# EAGLE design m5stack-doubleside-pinheader (EAGLE 8.6.3)
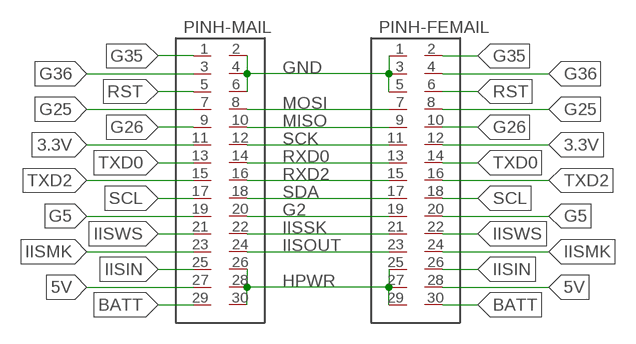
[diagram p0: schematic, sheet 1]

## Parts
PINH-FEMAIL  2X15  [SMD-PINH-2X15-C]
PINH-MAIL  2X15  [SMD-PINH-2X15-C]

## Nets
3.3V: PINH-FEMAIL.12 PINH-MAIL.11
5V: PINH-FEMAIL.28 PINH-MAIL.27
BATT: PINH-FEMAIL.30 PINH-MAIL.29
G2: PINH-FEMAIL.19 PINH-MAIL.20
G5: PINH-FEMAIL.20 PINH-MAIL.19
G25: PINH-FEMAIL.8 PINH-MAIL.7
G26: PINH-FEMAIL.10 PINH-MAIL.9
G35: PINH-FEMAIL.2 PINH-MAIL.1
G36: PINH-FEMAIL.4 PINH-MAIL.3
GND: PINH-FEMAIL.1 PINH-FEMAIL.3 PINH-FEMAIL.5 PINH-MAIL.2 PINH-MAIL.4 PINH-MAIL.6
HPWR: PINH-FEMAIL.25 PINH-FEMAIL.27 PINH-FEMAIL.29 PINH-MAIL.26 PINH-MAIL.28 PINH-MAIL.30
IISIN: PINH-FEMAIL.26 PINH-MAIL.25
IISMK: PINH-FEMAIL.24 PINH-MAIL.23
IISOUT: PINH-FEMAIL.23 PINH-MAIL.24
IISSK: PINH-FEMAIL.21 PINH-MAIL.22
IISWS: PINH-FEMAIL.22 PINH-MAIL.21
MISO: PINH-FEMAIL.9 PINH-MAIL.10
MOSI: PINH-FEMAIL.7 PINH-MAIL.8
RST: PINH-FEMAIL.6 PINH-MAIL.5
RXD0: PINH-FEMAIL.13 PINH-MAIL.14
RXD2: PINH-FEMAIL.15 PINH-MAIL.16
SCK: PINH-FEMAIL.11 PINH-MAIL.12
SCL: PINH-FEMAIL.18 PINH-MAIL.17
SDA: PINH-FEMAIL.17 PINH-MAIL.18
TXD0: PINH-FEMAIL.14 PINH-MAIL.13
TXD2: PINH-FEMAIL.16 PINH-MAIL.15

## Library data of the parts
PINH-FEMAIL PINH-MAIL = m5stack:2X15

## Board
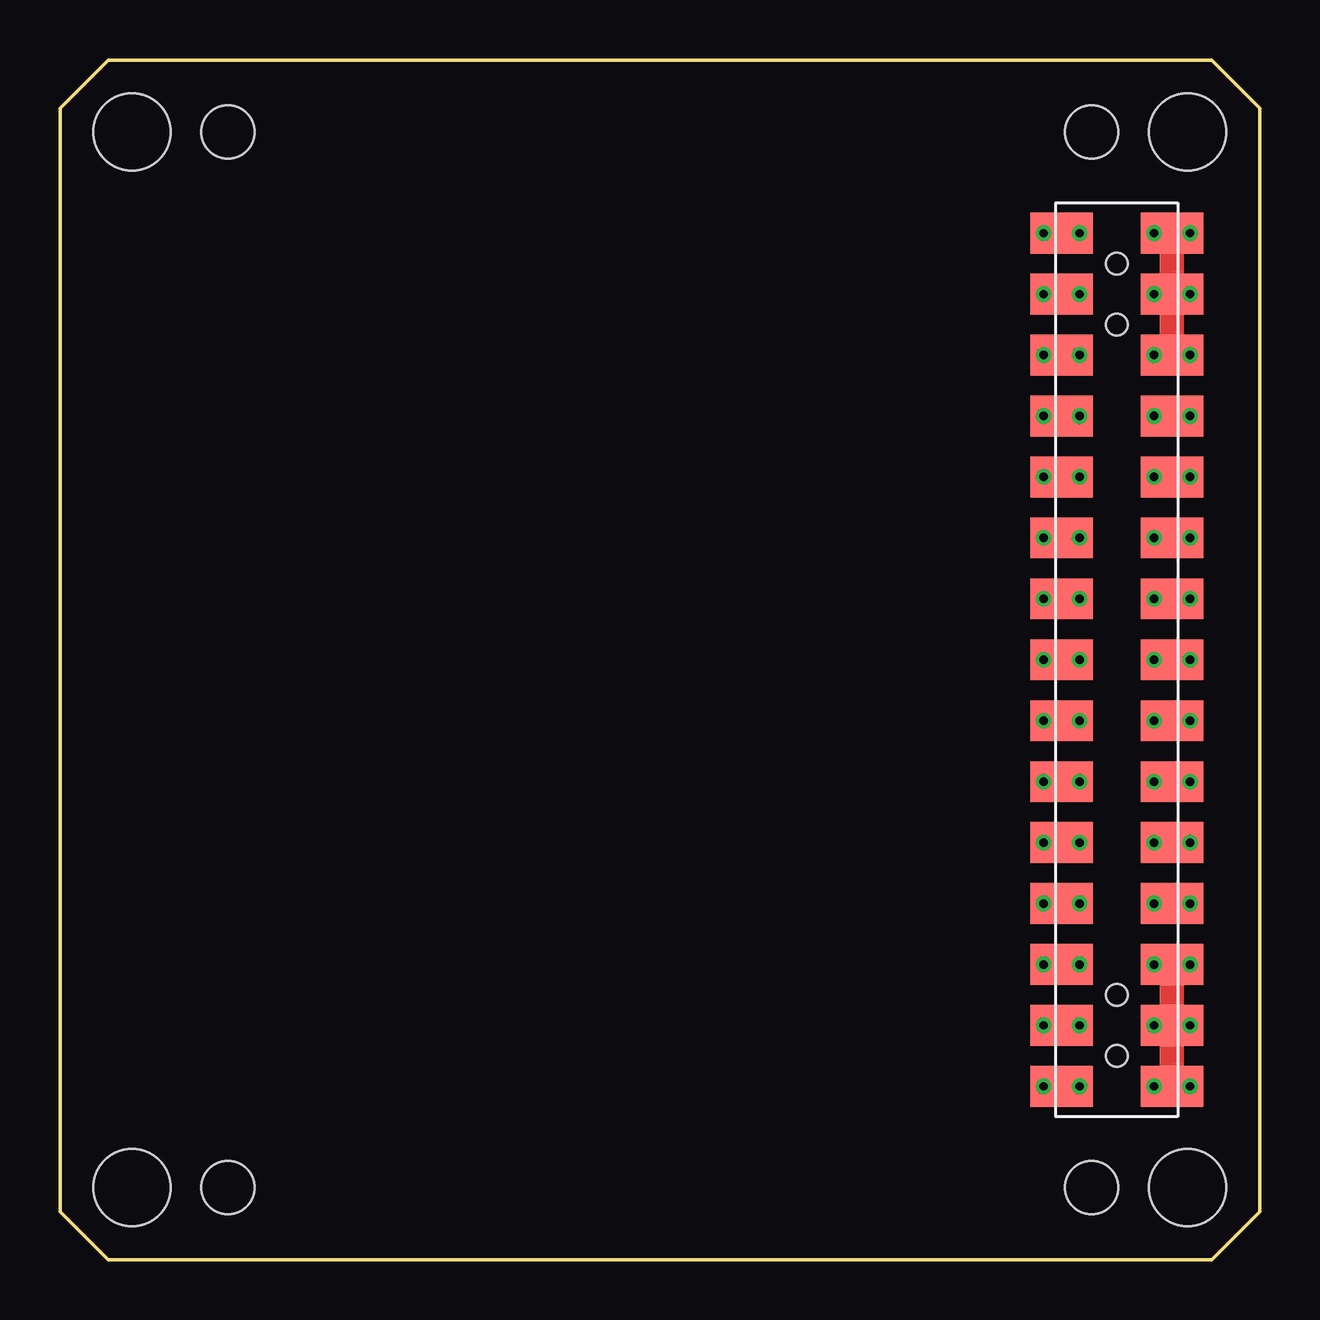
[diagram p1: board, top side]
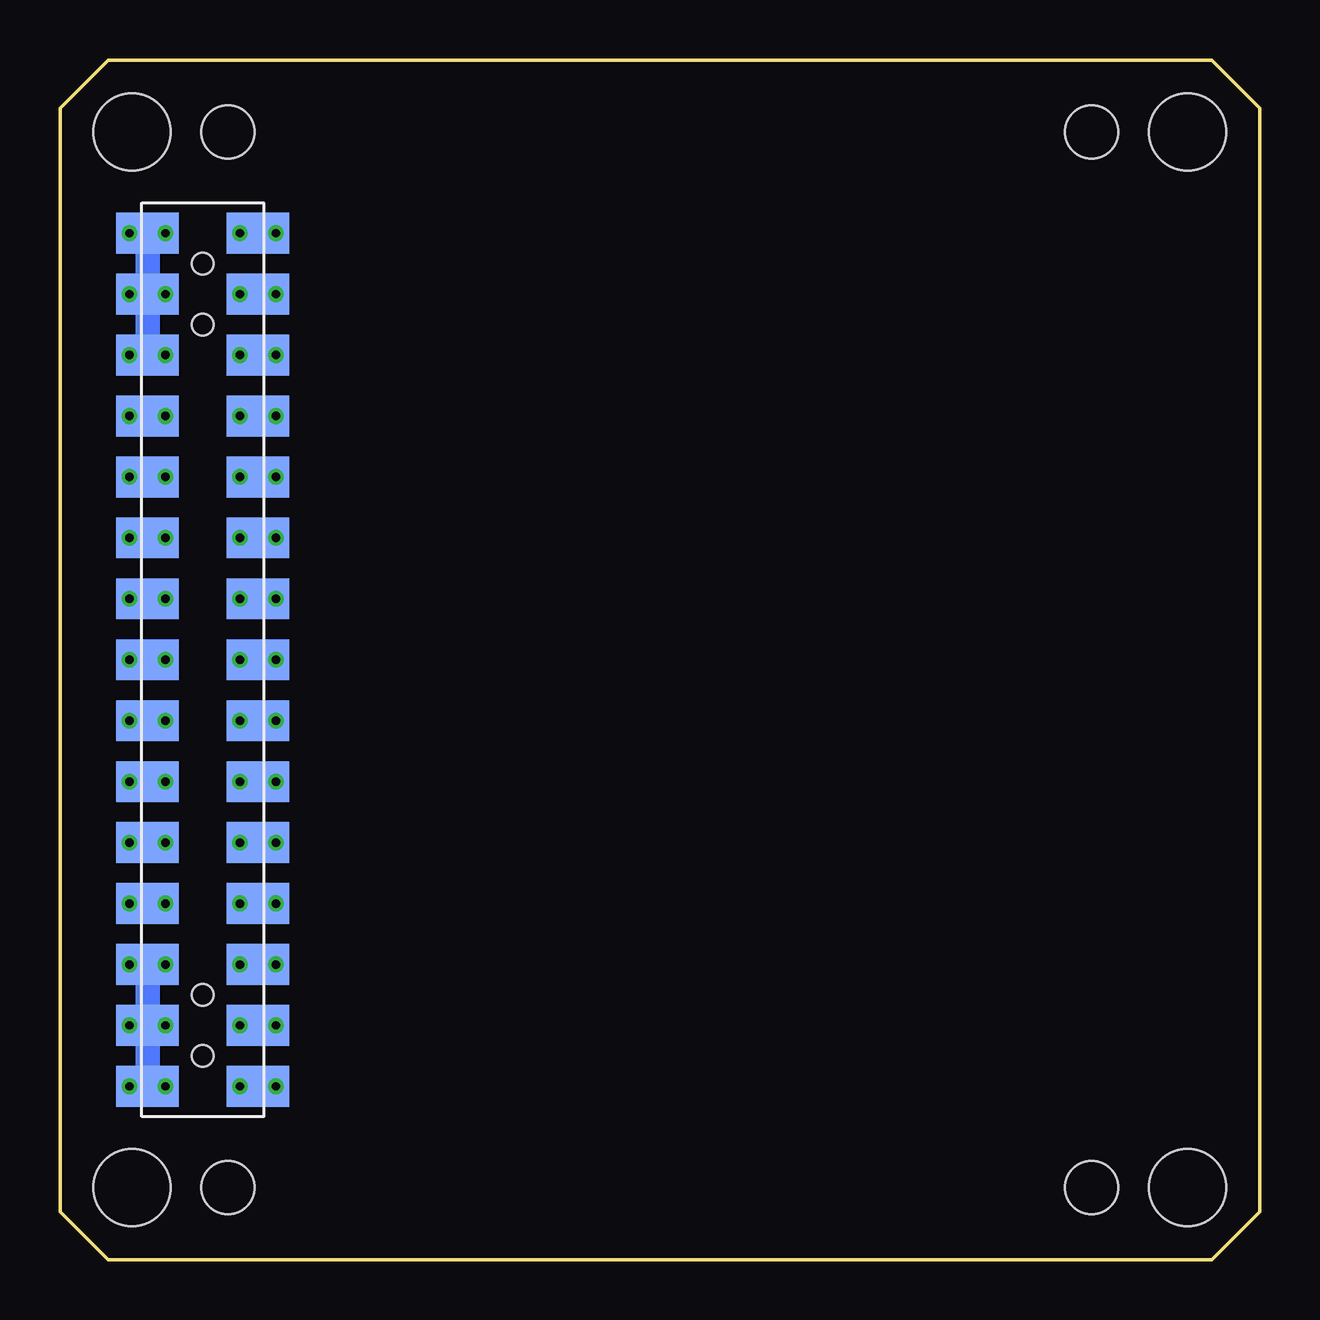
[diagram p2: board, bottom side, seen from below]

Size 50 x 50 mm. Coordinates in mm from the lower left corner, seen from the top.
Outline: 2,0 0,2 0,48 2,50 48,50 50,48 50,2 48,0 2,0
Copper layers (1*16): Top 0.035mm / dielectric 1.5mm / Bottom 0.035mm
Design rules "SeeedStudio_2layer_DRU_no_angle_20140221": minimum track width 6mil, minimum drill 12mil, track to track 6mil, track to pad 6mil, pad to pad 6mil, via to via 6mil, smd to smd 0mil, copper to edge 10mil, drill to drill 10mil, minimum pad ring 10mil, minimum via ring 6mil, stop-mask expansion 2mil, vias tented up to drill 100mil, thermal gap 10mil
Holes 3.2 mm at 3,47 3,3 47,47 47,3
Holes 2.2 mm at 7,47 7,3 43,3 43,47
Holes 0.9 mm at 44.05,41.51 44.05,38.97 44.05,11.03 44.05,8.49

### Footprints (pad centres in the part's own frame; a part is rotated, then mirrored left to right if it is on the bottom)
SMD-PINH-2X15-C = smd 2.6 x 1.7: 1 -2.3,17.78; 2 2.3,17.78; 3 -2.3,15.24; 4 2.3,15.24; 5 -2.3,12.7; 6 2.3,12.7; 7 -2.3,10.16; 8 2.3,10.16; 9 -2.3,7.62; 10 2.3,7.62; 11 -2.3,5.08; 12 2.3,5.08; 13 -2.3,2.54; 14 2.3,2.54; 15 -2.3,0; 16 2.3,0; 17 -2.3,-2.54; 18 2.3,-2.54; 19 -2.3,-5.08; 20 2.3,-5.08; 21 -2.3,-7.62; 22 2.3,-7.62; 23 -2.3,-10.16; 24 2.3,-10.16; 25 -2.3,-12.7; 26 2.3,-12.7; 27 -2.3,-15.24; 28 2.3,-15.24; 29 -2.3,-17.78; 30 2.3,-17.78

### Placement (x,y rotation side)
PINH-FEMAIL  44.05,25 0 bottom
PINH-MAIL  44.05,25 0 top

### Tracks (layer width: path | path; a pad name or v marks a point on that pad's centre or on a via)
3.3V  (via drill 0.35)
  Top 0.152: v41,30.08 PINH-MAIL.11 v42.5,30.08
  Bottom 0.152: v41,30.08 PINH-MAIL.11 v42.5,30.08
5V  (via drill 0.35)
  Top 0.152: v42.5,9.76 PINH-FEMAIL.28 v41,9.76
  Bottom 0.152: v41,9.76 PINH-FEMAIL.28 v42.5,9.76
BATT  (via drill 0.35)
  Top 0.152: v42.5,7.22 PINH-FEMAIL.30 v41,7.22
  Bottom 0.152: v41,7.22 PINH-FEMAIL.30 v42.5,7.22
G2  (via drill 0.35)
  Top 0.152: v45.6,19.92 PINH-FEMAIL.19 v47.1,19.92
  Bottom 0.152: v45.6,19.92 PINH-FEMAIL.19 v47.1,19.92
G5  (via drill 0.35)
  Top 0.152: v42.5,19.92 PINH-FEMAIL.20 v41,19.92
  Bottom 0.152: v41,19.92 PINH-FEMAIL.20 v42.5,19.92
G25  (via drill 0.35)
  Top 0.152: v41,35.16 PINH-MAIL.7 v42.5,35.16
  Bottom 0.152: v41,35.16 PINH-MAIL.7 v42.5,35.16
G26  (via drill 0.35)
  Top 0.152: v41,32.62 PINH-MAIL.9 v42.5,32.62
  Bottom 0.152: v41,32.62 PINH-MAIL.9 v42.5,32.62
G35  (via drill 0.35)
  Top 0.152: v41,42.78 PINH-FEMAIL.2 v42.5,42.78
  Bottom 0.152: v41,42.78 PINH-FEMAIL.2 v42.5,42.78
G36  (via drill 0.35)
  Top 0.152: v41,40.24 PINH-MAIL.3 v42.5,40.24
  Bottom 0.152: v41,40.24 PINH-MAIL.3 v42.5,40.24
GND  (via drill 0.35)
  Top 0.152: v45.6,42.78 PINH-MAIL.2 v47.1,42.78 | v47.1,40.24 PINH-MAIL.4 v45.6,40.24 | v45.6,37.7 PINH-MAIL.6 v47.1,37.7
  Top 1.016: PINH-MAIL.2 PINH-MAIL.4 PINH-MAIL.6
  Bottom 0.152: v45.6,42.78 PINH-MAIL.2 v47.1,42.78 | v45.6,40.24 PINH-MAIL.4 v47.1,40.24 | v45.6,37.7 PINH-MAIL.6 v47.1,37.7
  Bottom 1.016: PINH-MAIL.2 PINH-MAIL.4 PINH-MAIL.6
HPWR  (via drill 0.35)
  Top 0.152: v47.1,7.22 PINH-MAIL.30 v45.6,7.22 | v45.6,9.76 PINH-MAIL.28 v47.1,9.76 | v45.6,12.3 PINH-MAIL.26 v47.1,12.3
  Top 1.016: PINH-MAIL.26 PINH-MAIL.28 PINH-MAIL.30
  Bottom 0.152: v45.6,7.22 PINH-MAIL.30 v47.1,7.22 | v47.1,9.76 PINH-MAIL.28 v45.6,9.76 | v45.6,12.3 PINH-MAIL.26 v47.1,12.3
  Bottom 1.016: PINH-MAIL.30 PINH-MAIL.28 PINH-MAIL.26
IISIN  (via drill 0.35)
  Top 0.152: v41,12.3 PINH-FEMAIL.26 v42.5,12.3
  Bottom 0.152: v41,12.3 PINH-FEMAIL.26 v42.5,12.3
IISMK  (via drill 0.35)
  Top 0.152: v41,14.84 PINH-FEMAIL.24 v42.5,14.84
  Bottom 0.152: v41,14.84 PINH-FEMAIL.24 v42.5,14.84
IISOUT  (via drill 0.35)
  Top 0.152: v45.6,14.84 PINH-FEMAIL.23 v47.1,14.84
  Bottom 0.152: v45.6,14.84 PINH-FEMAIL.23 v47.1,14.84
IISSK  (via drill 0.35)
  Top 0.152: v45.6,17.38 PINH-FEMAIL.21 v47.1,17.38
  Bottom 0.152: v45.6,17.38 PINH-FEMAIL.21 v47.1,17.38
IISWS  (via drill 0.35)
  Top 0.152: v42.5,17.38 PINH-FEMAIL.22 v41,17.38
  Bottom 0.152: v41,17.38 PINH-FEMAIL.22 v42.5,17.38
MISO  (via drill 0.35)
  Top 0.152: v45.6,32.62 PINH-FEMAIL.9 v47.1,32.62
  Bottom 0.152: v45.6,32.62 PINH-FEMAIL.9 v47.1,32.62
MOSI  (via drill 0.35)
  Top 0.152: v45.6,35.16 PINH-FEMAIL.7 v47.1,35.16
  Bottom 0.152: v45.6,35.16 PINH-FEMAIL.7 v47.1,35.16
RST  (via drill 0.35)
  Top 0.152: v41,37.7 PINH-MAIL.5 v42.5,37.7
  Bottom 0.152: v41,37.7 PINH-MAIL.5 v42.5,37.7
RXD0  (via drill 0.35)
  Top 0.152: v45.6,27.54 PINH-FEMAIL.13 v47.1,27.54
  Bottom 0.152: v47.1,27.54 PINH-FEMAIL.13 v45.6,27.54
RXD2  (via drill 0.35)
  Top 0.152: v45.6,25 PINH-FEMAIL.15 v47.1,25
  Bottom 0.152: v45.6,25 PINH-FEMAIL.15 v47.1,25
SCK  (via drill 0.35)
  Top 0.152: v47.1,30.08 PINH-FEMAIL.11 v45.6,30.08
  Bottom 0.152: v45.6,30.08 PINH-FEMAIL.11 v47.1,30.08
SCL  (via drill 0.35)
  Top 0.152: v42.5,22.46 PINH-FEMAIL.18 v41,22.46
  Bottom 0.152: v41,22.46 PINH-FEMAIL.18 v42.5,22.46
SDA  (via drill 0.35)
  Top 0.152: v45.6,22.46 PINH-FEMAIL.17 v47.1,22.46
  Bottom 0.152: v45.6,22.46 PINH-FEMAIL.17 v47.1,22.46
TXD0  (via drill 0.35)
  Top 0.152: v41,27.54 PINH-MAIL.13 v42.5,27.54
  Bottom 0.152: v41,27.54 PINH-MAIL.13 v42.5,27.54
TXD2  (via drill 0.35)
  Top 0.152: v41,25 PINH-MAIL.15 v42.5,25
  Bottom 0.152: v41,25 PINH-MAIL.15 v42.5,25